# Altium schematic sheet QSPI_WSON.SchDoc: QSPI Magic
size Letter; Organization: NewAE Technology Inc.; Address1: 1083 Queen St., Suite 196; Address2: Halifax; Address3: NS; Address4: Canada B3H 0B2; DocumentNumber: .; Revision: .; SheetNumber: 1; SheetTotal: 1; SheetApproved: NO
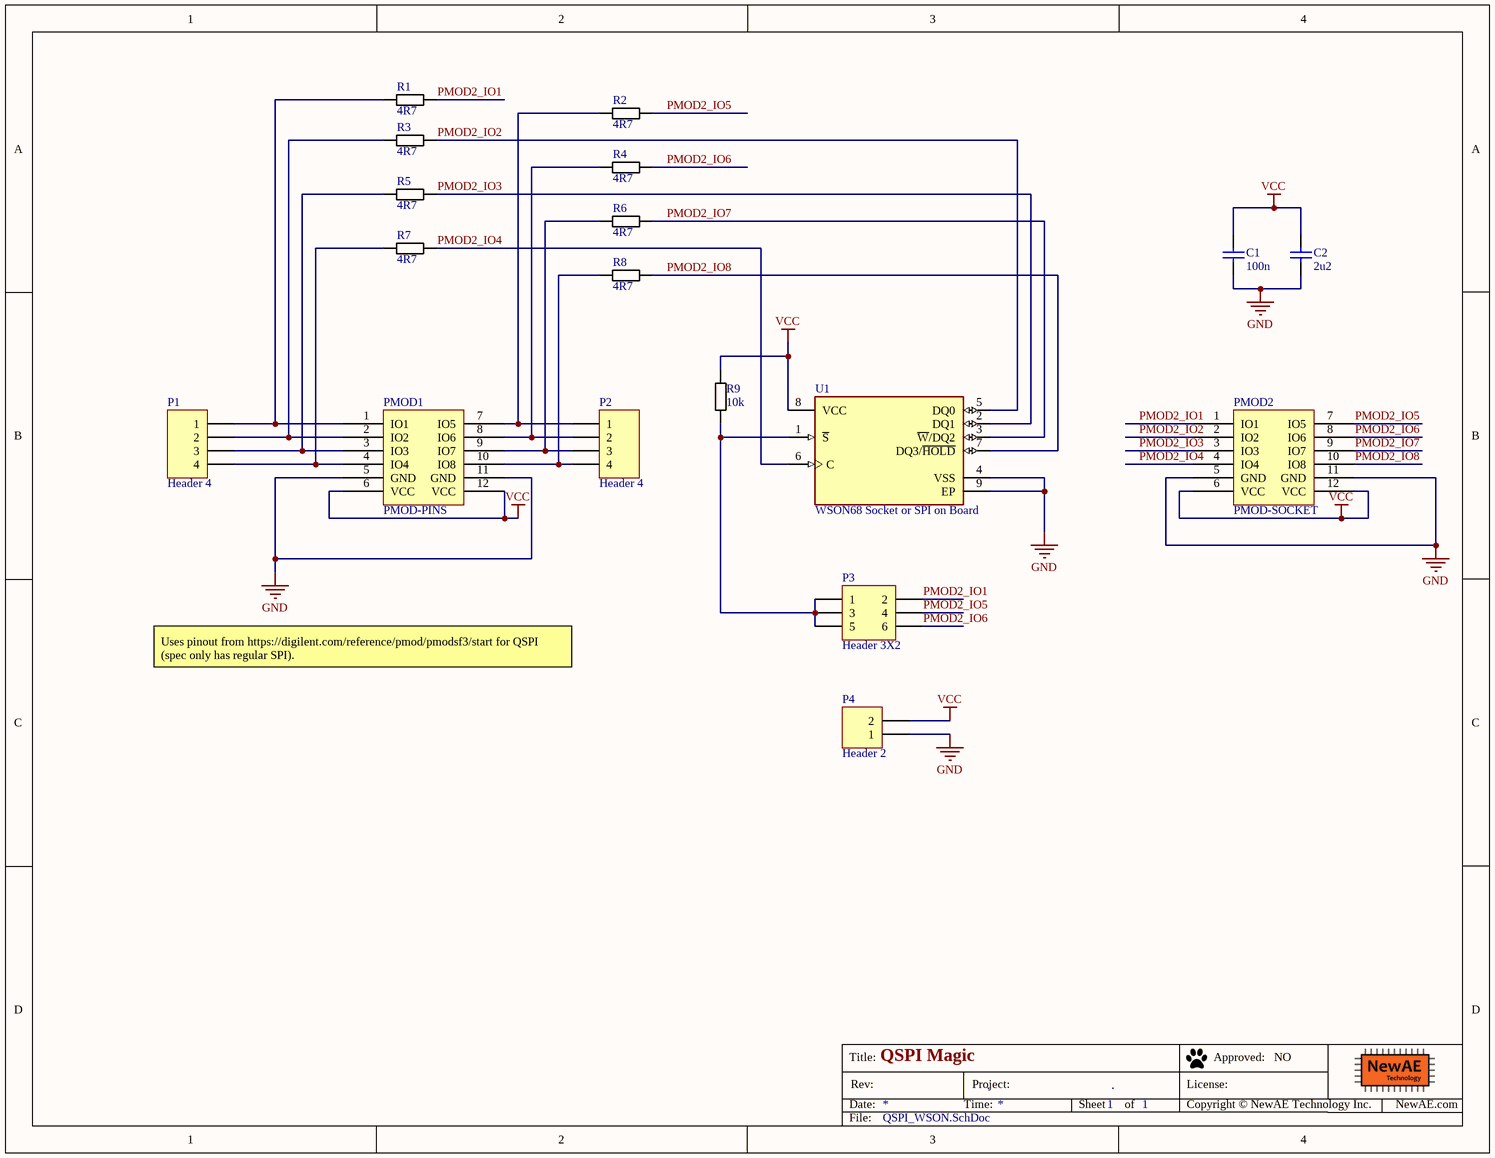
[diagram p0: QSPI_WSON.SchDoc]

## Parts
C1  100n  [CAPC0603_M]
C2  2u2  [CAPC0603_M]
P1  Header 4  [HDR1X4]
P2  Header 4  [HDR1X4]
P3  Header 3X2  [HDR2X3]
P4  Header 2  [HDR1X2]
PMOD1  PMOD-PINS  [PMOD-68021-212HLF-MALE]
PMOD2  PMOD-SOCKET  [SAMTEC_SSW_106_02_X_D_RA_PMOD]
R1  4R7  [RESC1608X55N]
R2  4R7  [RESC1608X55N]
R3  4R7  [RESC1608X55N]
R4  4R7  [RESC1608X55N]
R5  4R7  [RESC1608X55N]
R6  4R7  [RESC1608X55N]
R7  4R7  [RESC1608X55N]
R8  4R7  [RESC1608X55N]
R9  10k  [RESC1608X55N]
U1  WSON68 Socket or SPI on Board  [SOK-SPI-WSON68_ORCHIP]

## Nets
GND: C1.2 C2.2 P4.1 PMOD1.5(GND) PMOD1.11(GND) PMOD2.5(GND) PMOD2.11(GND) U1.4(VSS) U1.9(EP)
VCC: C1.1 C2.1 P4.2 PMOD1.6(VCC) PMOD1.12(VCC) PMOD2.6(VCC) PMOD2.12(VCC) R9.2 U1.8(VCC)
PMOD2_IO1: P3.2 PMOD2.1(IO1) R1.2
PMOD2_IO2: PMOD2.2(IO2) R3.2 U1.5(DQ0)
PMOD2_IO3: PMOD2.3(IO3) R5.2 U1.2(DQ1)
PMOD2_IO4: PMOD2.4(IO4) R7.2 U1.6(C)
PMOD2_IO5: P3.4 PMOD2.7(IO5) R2.2
PMOD2_IO6: P3.6 PMOD2.8(IO6) R4.2
PMOD2_IO7: PMOD2.9(IO7) R6.2 U1.3(~{W}/DQ2)
PMOD2_IO8: PMOD2.10(IO8) R8.2 U1.7(DQ3/~{HOLD})
NetP1_1: P1.1 PMOD1.1(IO1) R1.1
NetP1_2: P1.2 PMOD1.2(IO2) R3.1
NetP1_3: P1.3 PMOD1.3(IO3) R5.1
NetP1_4: P1.4 PMOD1.4(IO4) R7.1
NetP2_1: P2.1 PMOD1.7(IO5) R2.1
NetP2_2: P2.2 PMOD1.8(IO6) R4.1
NetP2_3: P2.3 PMOD1.9(IO7) R6.1
NetP2_4: P2.4 PMOD1.10(IO8) R8.1
NetP3_1: P3.1 P3.3 P3.5 R9.1 U1.1(~{S})

## Notes on the sheet
- Uses pinout from https://digilent.com/reference/pmod/pmodsf3/start for QSPI (spec only has regular SPI).
- Title:
- Date:
- Rev:
- Time:
- Project:
- Sheet
- of
- License:
- Copyright © NewAE Technology Inc.
- Approved:
- NewAE.com
- File:

## Library data of the parts
C1 = CCHIP-100n-0603: 100n, 0603; Manufacture 1: Kemet; Manufacture Part Number 1: C0603C104K5RACTU; Component Group: Capacitor; Case-EIA: 0603; Case-Metric: 1608; Rated Voltage: 50VDC; Part Number: CCHIP-100n-0603; Footprint: 0603; Pin Count: 2; Supplier 1: Digi-Key; Supplier Part Number 1: 399-5089-2-ND; Value: 100n; Mounting Technology: SMT; Component Kind: Standard; Component Type: Standard
C2 = CCHIP-2u2-0603: 2u2, 0603; Manufacture 1: Samsung; Manufacture Part Number 1: CL10B225KP8NNNC; Component Group: Capacitor; Case-EIA: 0603; Case-Metric: 1608; Rated Voltage: 10VDC; Part Number: CCHIP-2u2-0603; Footprint: 0603; Pin Count: 2; Supplier 1: Digi-Key; Supplier Part Number 1: 1276-1134-1-ND; Value: 2u2; Mounting Technology: SMT; Component Kind: Standard; Component Type: Standard
P1 P2 = Header 4: Header, 4-Pin; LatestRevisionDate: 17-Jul-2002; LatestRevisionNote: Re-released for DXP Platform.; Publisher: Altium Limited
P3 = CMP-011-000094-1: Header, 3-Pin, Dual row; Signal Integrity: Connector; LatestRevisionNote: Re-released for DXP Platform.; Design Item ID: Header 3X2; Publisher: Altium Limited; Pin Count: 6; Component Type: Standard; Source: Miscellaneous Connectors.SchLib; LatestRevisionDate: 17-Jul-2002
P4 = CMP-004-000001-1: Header, 2-Pin; Signal Integrity: Connector; Pin Count: 2; Source: CW313_20pinToTarget.SCHLIB; LatestRevisionNote: Re-released for DXP Platform.; LatestRevisionDate: 17-Jul-2002; Design Item ID: Header 2; Publisher: Altium Limited; Component Type: Standard
PMOD1 = PMOD_2ROW_MALERATH: Component Group: Connector; PP Material Stack: 0; Part Number: PMOD_2ROW_MALERATH; Pin Count: 12; Supplier 1: Digi-Key; Component Kind: Standard; Component Type: Standard; PP Rotation: 0; PP Rotation1: 0
PMOD2 = PMOD_2ROW_FEMALERATH: Component Group: Connector; PP Material Stack: 0; Part Number: PMOD_2ROW_FEMALERATH; Pin Count: 12; Supplier 1: Digi-Key; Supplier Part Number 1: SAM1215-06-ND; Component Kind: Standard; Component Type: Standard; PP Rotation: 0; PP Rotation1: 0
R1-R8 = RCHIP-4R7-0603: 4R7 res, 0603, 1%, 1/10W; Manufacture 1: Yageo; Manufacture Part Number 1: RC0603FR-074R7L; Component Group: Resistor; Case-EIA: 0603; Case-Metric: 1608; Rated Power: 0.1W; Rated Voltage: 75VDC; Part Number: RCHIP-4R7-0603; Footprint: 0603; Pin Count: 2; Supplier 1: Digi-Key; Supplier Part Number 1: YAG3371CT-ND; Value: 4R7; Tolerance: 1%; Mounting Technology: SMT; Temperature Range: -55C to 155C; Component Kind: Standard; Component Type: Standard
R9 = RCHIP-10K-0603: 10k res, 0603, 1%, 1/10W; Manufacture 1: Yageo; Manufacture Part Number 1: RC0603FR-0710KL; Component Group: Resistor; Case-EIA: 0603; Case-Metric: 1608; Rated Power: 0.1W; Rated Voltage: 75VDC; Part Number: RCHIP-10K-0603; Footprint: 0603; Pin Count: 2; Supplier 1: Digi-Key; Supplier Part Number 1: 311-10.0KHRCT-ND; Value: 10k; Tolerance: 1%; Mounting Technology: SMT; Temperature Range: -55C to 155C; Component Kind: Standard; Component Type: Standard
U1 = SOK-SPI-WSON68_OR_QSPI: WSON-6x8 Socket OR WSON Flash; Manufacture 1: Dedi-Prog/Micron; Manufacture Part Number 1: SOK-SPI-WSON68 / MT25QL256ABA1EW9-0SIT; Component Group: Connector; PP Material Stack: 0; Part Number: SOK-SPI-WSON68_OR_QSPI; Footprint: WSON-8x6; Pin Count: 8; Supplier 1: Digi-Key; Mounting Technology: SMT; RoHS: Yes; Component Kind: Standard; Component Type: Standard; PP Rotation: 0; PP Rotation1: 0